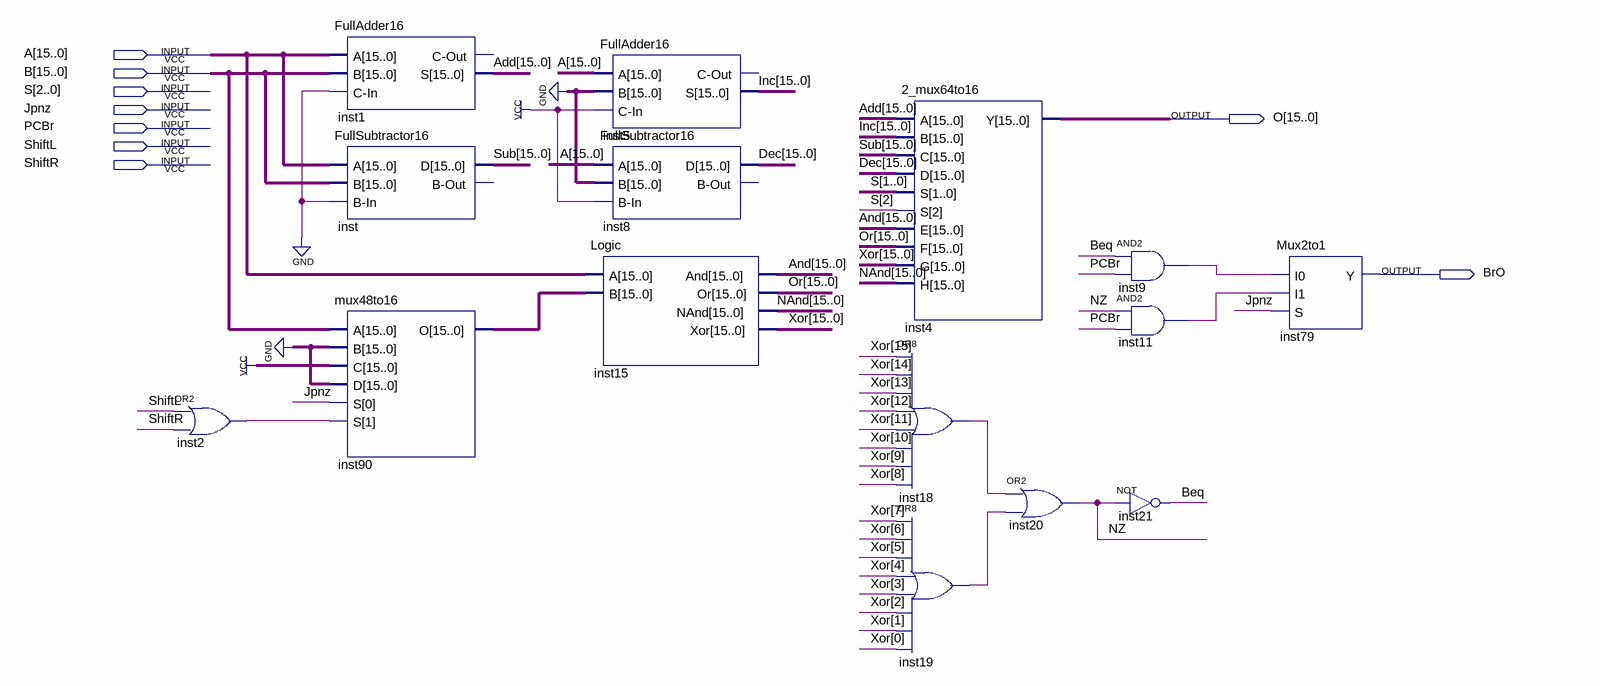
[diagram p0: schematic sheet]
// Quartus schematic ALU.bdf as structural Verilog: 15 symbols, 9 pins
module ALU (
  input  [15:0] A,
  input  [15:0] B,
  input  [2:0] S,
  input  Jpnz,
  input  PCBr,
  input  ShiftL,
  input  ShiftR,
  output [15:0] O,
  output BrO
);

  wire Beq, inst2_out, inst9_out, inst11_out, inst18_out, inst19_out, NZ;
  wire [15:0] Add, And, Dec, Inc, inst90_o, NAnd, Or, Sub, Xor;

  or inst2 (inst2_out, ShiftL, ShiftR);
  FullAdder16 inst1 (.A(A), .B(B), .\C-In (1'b0), .S(Add));  // open: C-Out
  FullSubtractor16 inst (.A(A), .B(B), .\B-In (1'b0), .D(Sub));  // open: B-Out
  mux48to16 inst90 (.A(B), .B({16{1'b0}}), .C({16{1'b1}}), .D({16{1'b0}}), .S({inst2_out, Jpnz}), .O(inst90_o));
  FullAdder16 inst5 (.A(A), .B({16{1'b0}}), .\C-In (1'b1), .S(Inc));  // open: C-Out
  FullSubtractor16 inst8 (.A(A), .B({16{1'b0}}), .\B-In (1'b1), .D(Dec));  // open: B-Out
  Logic inst15 (.A(A), .B(inst90_o), .And(And), .Or(Or), .NAnd(NAnd), .Xor(Xor));
  \2_mux64to16  inst4 (.A(Add), .B(Inc), .C(Sub), .D(Dec), .S(S), .E(And), .F(Or), .G(Xor), .H(NAnd), .Y(O));
  or inst18 (inst18_out, Xor[15], Xor[14], Xor[13], Xor[12], Xor[11], Xor[10], Xor[9], Xor[8]);
  or inst19 (inst19_out, Xor[7], Xor[6], Xor[5], Xor[4], Xor[3], Xor[2], Xor[1], Xor[0]);
  or inst20 (NZ, inst18_out, inst19_out);
  and inst9 (inst9_out, Beq, PCBr);
  and inst11 (inst11_out, NZ, PCBr);
  not inst21 (Beq, NZ);
  Mux2to1 inst79 (.I0(inst9_out), .I1(inst11_out), .S(Jpnz), .Y(BrO));
endmodule
